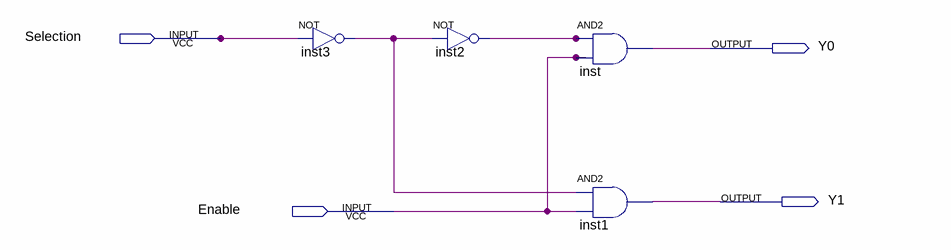
[diagram p0: schematic sheet]
// Quartus schematic decoder1to2.bdf as structural Verilog: 4 symbols, 4 pins
module decoder1to2 (
  input  Selection,
  input  Enable,
  output Y0,
  output Y1
);

  wire inst2_out, inst3_out;

  not inst3 (inst3_out, Selection);
  not inst2 (inst2_out, inst3_out);
  and inst (Y0, inst2_out, Enable);
  and inst1 (Y1, inst3_out, Enable);
endmodule
